# Altium schematic sheet [05]-SW420.SchDoc
size A4; Organization: Indruino Co., Ltd; Address1: No. 1, Vo Van Ngan Street; Address2: Thu Duc District, HCMC; SheetNumber: 6; SheetTotal: 9
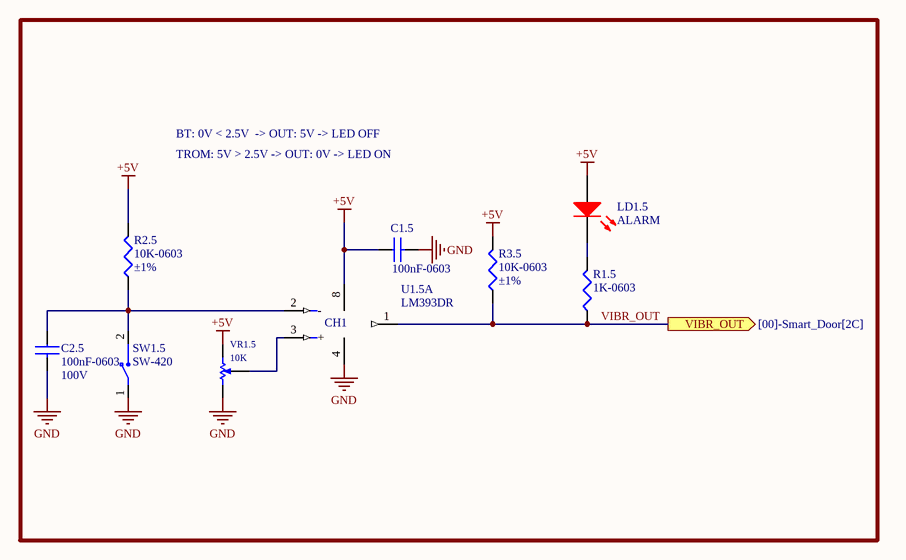
[diagram p0: [05]-SW420.SchDoc]

## Parts
C1.5  100nF-0603  [CAP0603]
C2.5  100nF-0603  Voltage - Rated: 100V  [CAP0603]
LD1.5  ALARM  [LED_SMD0603_RED]
R1.5  1K-0603  [RES0603]
R2.5  10K-0603  Tolerance: ±1%  [RES0603]
R3.5  10K-0603  Tolerance: ±1%  [RES0603]
SW1.5  SW-420  [SW-420]
U1.5  LM393DR  [SOP8]  (part A of 2)
VR1.5  10K  [VARIABLE RESISTOR_3362P]

## Ports
VIBR_OUT (out, see [00]-Smart_Door[2C])

## Nets
+5V: C1.5.1 LD1.5.1(A) R2.5.2 R3.5.2 U1.5.8(VCC) VR1.5.1
GND: C1.5.2 C2.5.2 SW1.5.1 U1.5.4(GND) VR1.5.3
VIBR_OUT: R1.5.1 R3.5.1 U1.5.1(OUT1) ; port VIBR_OUT
NetC2.5_1: C2.5.1 R2.5.1 SW1.5.2 U1.5.2(-)
NetLD1.5_2: LD1.5.2(K) R1.5.2
NetU1.5_3: U1.5.3(+) VR1.5.2

## Notes on the sheet
- BT: 0V < 2.5V  -> OUT: 5V -> LED OFF
- TROM: 5V > 2.5V -> OUT: 0V -> LED ON
- Title
- Size:
- Date:
- Author:
- A4
- Time:
- Number:
- Checked:
- Revision:
- Sheet
- Approved:
- of
- File:
- (in symbol LM393DR, part A) CH1

## Library data of the parts
C1.5 C2.5 = CC0603KRX7R0BB104: CAP CER 0.1UF 100V X7R 0603; Manufacturer: Yageo; Tolerance: ±10%; Value: 100nF; Supplier 1: Digi-Key; Manufacturer Part Number: CC0603KRX7R0BB104; RoHS: RoHS Compliant; Category: Capacitors; Stock 1: 784508; Pricing 1: 1=0.23, 10=0.156, 100=0.0791, 500=0.05414, 1000=0.0479 (USD); Packaging: Cut Tape (CT); Part Status: Active; Temperature Coefficient: X7R; Operating Temperature: -55°C ~ 125°C; Features: -; Ratings: -; Applications: General Purpose; Failure Rate: -; Mounting Type: Surface Mount, MLCC; Package / Case: 0603 (1608 Metric); Size / Dimension: 0.063" L x 0.032" W (1.60mm x 0.80mm); Height - Seated (Max): -; Thickness (Max): 0.035" (0.90mm); Lead Spacing: -; Lead Style: -; ComponentLink1URL: http://media.digikey.com/pdf/Data%20Sheets/Yageo%20PDFs/NPO,%20X7R%20Mid-voltage.pdf; ComponentLink1Description: http://media.digikey.com/pdf/Data%20Sheets/Yageo%20PDFs/NPO,%20X7R%20Mid-voltage.pdf; Supplier Part Number 1: 311-1523-1-ND
  C1.5: Voltage - Rated: 100V
LD1.5 = LED_LTST-C191KRKT: LED RED CLEAR 0603 SMD; Manufacturer: Lite-On Inc.; Lens Color: Colorless; Millicandela Rating: 54mcd; Lens Style/Size: Rectangle with Flat Top, 1.10mm x 0.80mm; Voltage - Forward (Vf) (Typ): 2V; Current - Test: 20mA; Viewing Angle: 130°; Wavelength - Dominant: 631nm; Wavelength - Peak: 639nm; Supplier 1: Digi-Key; Manufacturer Part Number: LTST-C191KRKT; RoHS: RoHS Compliant; Category: Optoelectronics; Stock 1: 711347; Pricing 1: 1=0.29, 10=0.211, 25=0.1556, 100=0.1111, 250=0.07556, 500=0.06666, 1000=0.05222, 2500=0.05111 (USD); Packaging: Digi-Reel®; Part Status: Active; Color: Red; Lens Transparency: Clear; Mounting Type: Surface Mount; Features: -; Size / Dimension: 1.60mm L x 0.80mm W; Height (Max): 0.65mm; ComponentLink1URL: http://optoelectronics.liteon.com/upload/download/DS22-2000-223/LTST-C191KRKT.PDF; ComponentLink1Description: http://optoelectronics.liteon.com/upload/download/DS22-2000-223/LTST-C191KRKT.PDF; Supplier Part Number 1: 160-1447-6-ND; Package / Case: 0603 (1608 Metric)
R1.5 = RC0603JR-071KL: RES SMD 1K OHM 5% 1/10W 0603; Manufacturer 1: Yageo; Category 1: Resistors; Power (Watts): 0.1W, 1/10W; Temperature Coefficient: ±100ppm/°C; Supplier 1: Digi-Key; Supplier Part Number 1: 311-1.0KGRCT-ND; Manufacturer Part Number 1: RC0603JR-071KL; RoHS 1: RoHS Compliant; Description 1: RES SMD 1K OHM 5% 1/10W 0603; Stock 1: 2853955; Pricing 1: 1=0.1, 10=0.011, 100=0.0044, 1000=0.00198, 2500=0.00172 (USD); Packaging: Cut Tape (CT); Part Status: Active; Resistance (Ohms): 1k; Tolerance: ±5%; Composition: Thick Film; Features: Moisture Resistant; Operating Temperature: -55°C ~ 155°C; Package / Case: 0603 (1608 Metric); Supplier Device Package: 0603; Size / Dimension: 0.063" L x 0.031" W (1.60mm x 0.80mm); Height - Seated (Max): 0.022" (0.55mm); Failure Rate: -; ComponentLink1URL: http://www.yageo.com/documents/recent/PYu-RC_Group_51_RoHS_L_7.pdf; ComponentLink1Description: http://www.yageo.com/documents/recent/PYu-RC_Group_51_RoHS_L_7.pdf; Value: 1K
R2.5 R3.5 = RC0603FR-0710KL: RES SMD 10K OHM 1% 1/10W 0603; Manufacturer: Yageo; Power (Watts): 0.1W, 1/10W; Temperature Coefficient: ±100ppm/°C; Supplier 1: Digi-Key; Manufacturer Part Number: RC0603FR-0710KL; RoHS: RoHS Compliant; Category: Resistors; Stock 1: 16545228; Pricing 1: 1=0.1, 10=0.015, 100=0.006, 1000=0.00268, 2500=0.00233 (USD); Packaging: Cut Tape (CT); Part Status: Active; Composition: Thick Film; Features: Moisture Resistant; Operating Temperature: -55°C ~ 155°C; Package / Case: 0603 (1608 Metric); Supplier Device Package: 0603; Size / Dimension: 0.063" L x 0.032" W (1.60mm x 0.80mm); Height - Seated (Max): 0.022" (0.55mm); Failure Rate: -; ComponentLink1URL: http://www.yageo.com/documents/recent/PYu-RC_Group_51_RoHS_L_7.pdf; ComponentLink1Description: http://www.yageo.com/documents/recent/PYu-RC_Group_51_RoHS_L_7.pdf; Supplier Part Number 1: 311-10.0KHRCT-ND; Value: 10K
U1.5 = LM393DR: Analogue Comparator, Dual, Differential, 2, 1.3 s, 2V to 36V, SOIC, 8; Manufacturer 1: Texas Instruments; Nominal Supply Current: 1mA; Voltage Gain: 106.02dB; Min Dual Supply Voltage: 1V; Max Dual Supply Voltage: 18V; Number of Elements: 2; Max Supply Current: 500uA; Input Bias Current: 250nA; Input Offset Voltage (Vos): 5mV; Response Time: 1.3us; Output Current: 20mA; Quiescent Current: 2.5mA; Output Type: TTL; Output Current per Channel: 6mA; Dual Supply Voltage: 9V; Operating Supply Voltage: 28V; Supplier 1: Digi-Key; Supplier Part Number 1: 296-1015-1-ND; Manufacturer Part Number 1: LM393DR; RoHS 1: Yes; Description 1: Analogue Comparator, Dual, Differential, 2, 1.3 s, 2V to 36V, SOIC, 8; Category: Amplifiers - Op Amps, Buffer, Instrumentation; Pricing 1: 1=0.43000, 10=0.34900, 25=0.31920, 100=0.23740, 250=0.21520, 500=0.17808, 1000=0.13356 (USD); Mount: Surface Mount; Case/Package: SOIC; Number of Pins: 8; Weight: 0.002561oz; Contact Plating: Tin,Matte; Min Operating Temperature: 0°C; Max Operating Temperature: 70°C; Packaging: Tape and Reel; Min Supply Voltage: 2V; Package Quantity: 2500; Max Supply Voltage: 36V; Number of Channels: 2; Max Input Current: 250nA; Length: 4.9mm; Width: 3.91mm; Height: 1.58mm; Radiation Hardening: No; RoHS Compliant: Yes; Lead Free: Lead Free; REACH SVHC: No SVHC; ComponentLink1URL: https://datasheet.ciiva.com/39121/2016348-39121652.pdf?src-supplier=Jameco; ComponentLink1Description: https://datasheet.ciiva.com/39121/2016348-39121652.pdf?src-supplier=Jameco; ComponentLink2URL: https://datasheet.ciiva.com/4463/lm2903-12174-4463248.pdf?src-supplier=Mouser; ComponentLink2Description: https://datasheet.ciiva.com/4463/lm2903-12174-4463248.pdf?src-supplier=Mouser; ComponentLink3URL: https://datasheet.ciiva.com/15131/getdatasheetpartid-247469-15131090.pdf?src-supplier=Verical; ComponentLink3Description: https://datasheet.ciiva.com/15131/getdatasheetpartid-247469-15131090.pdf?src-supplier=Verical; ComponentLink4URL: https://datasheet.ciiva.com/46390/1874624-46390523.pdf?src-supplier=Element14; ComponentLink4Description: https://datasheet.ciiva.com/46390/1874624-46390523.pdf?src-supplier=Element14; ComponentLink5URL: https://datasheet.ciiva.com/1827/lm393-1827146.pdf?src-supplier=Digi-Key; ComponentLink5Description: https://datasheet.ciiva.com/1827/lm393-1827146.pdf?src-supplier=Digi-Key; ComponentLink6URL: https://datasheet.ciiva.com/1827/lm393-1827145.pdf?src-supplier=Digi-Key; ComponentLink6Description: https://datasheet.ciiva.com/1827/lm393-1827145.pdf?src-supplier=Digi-Key; ComponentLink7URL: https://datasheet.ciiva.com/1827/lm393-1827147.pdf?src-supplier=Digi-Key; ComponentLink7Description: https://datasheet.ciiva.com/1827/lm393-1827147.pdf?src-supplier=Digi-Key; ComponentLink8URL: https://datasheet.ciiva.com/7648/1847527-7648911.pdf?src-supplier=Element14; ComponentLink8Description: https://datasheet.ciiva.com/7648/1847527-7648911.pdf?src-supplier=Element14; ComponentLink9URL: https://datasheet.ciiva.com/2970/lm2903-2970518.pdf?src-supplier=Avnet; ComponentLink9Description: https://datasheet.ciiva.com/2970/lm2903-2970518.pdf?src-supplier=Avnet; ComponentLink10URL: https://datasheet.ciiva.com/26210/lm2903-26210635.pdf?src-supplier=Avnet+Europe; ComponentLink10Description: https://datasheet.ciiva.com/26210/lm2903-26210635.pdf?src-supplier=Avnet+Europe
VR1.5 = Variable Resistor: Square Trimming Potentiometer; AEMS Code: 1400226